# Altium schematic sheet TUDSSL_condenar__Hardware_PCBs_PowerModules_CrankModuleSMARTEST_TUD-EHC-CrankModule_SMARTEST__2_MCU.schdoc
size 309 x 223 mm; Symbol: Sheet-Symbol_A4; Device: Sheet-Symbol_A4; Company: EasyEDA.com; Drawed: EasyEDA Pro; Reviewed: EasyEDA Pro; Version: V0.1; Page Size: A4; @Project Name: TUD-EnergyHarvestingConsole_2022-08-29_17-01-09; @Page Count: 2; @Update Date: 2023-04-17; @Create Date: 2023-01-30; @Schematic Name: TUD-EHC-CrankModule_SMARTEST; Part Number: JLCPCB-002; @Page No: 2; @Page Name: MCU
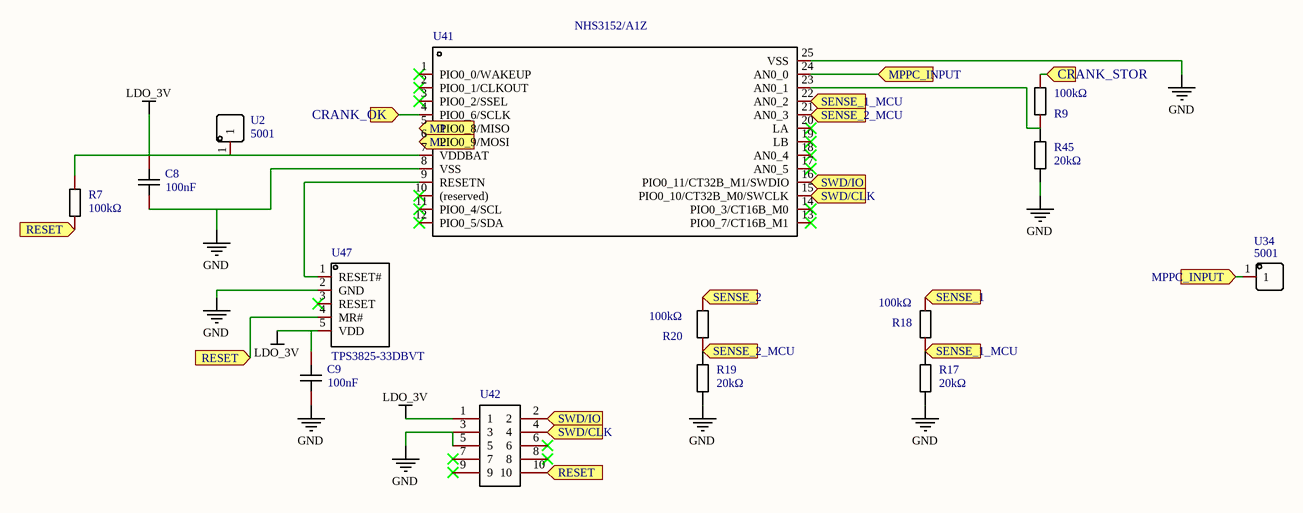
[diagram p0: TUDSSL_condenar__Hardware_PCBs_PowerModules_CrankModuleSMARTEST_TUD-EHC-CrankModule_SMARTEST__2_MCU.schdoc]

## Parts
C8  100nF  [C0603]
C9  100nF  [C0603]
R7  100kΩ  [R0603]
R9  100kΩ  [R0603]
R17  20kΩ  [R0603]
R18  100kΩ  [R0603]
R19  20kΩ  [R0603]
R20  100kΩ  [R0603]
R45  20kΩ  [R0603]
U2  5001  [TEST-TH_BD2.54-P1.39]
U34  5001  [TEST-TH_BD2.54-P1.39]
U41  NHS3152/A1Z  [QFN-24_L4.0-W4.0-P0.50-BL-EP2.6]
U42  20021121-00010T4LF  [HDR-SMD_10P-P1.27-V-M-R2-C5-S1.27-LS5.5]  (value not drawn)
U47  TPS3825-33DBVT  [SOT-23-5_L3.0-W1.7-P0.95-LS2.8-BL]

## Ports
CRANK_OK (in), CRANK_STOR (in), M1 (in), M2 (in), MPPC_INPUT (in), RESET (in), SENSE_1 (in), SENSE_1_MCU (in), SENSE_2 (in), SENSE_2_MCU (in), SWD/CLK (in), SWD/IO (in)

## Nets
GND: C8.2 C9.2 R17.2 R19.2 R45.2 U41.8(VSS) U41.25(VSS) U42.3 U42.5 U47.2(GND)
LDO_3V: C8.1 C9.1 R7.1 U2.1 U41.7(VDDBAT) U42.1 U47.5(VDD)
CRANK_OK: U41.4(PIO0_6/SCLK) ; port CRANK_OK
CRANK_STOR: R9.2 ; port CRANK_STOR
M1: U41.5(PIO0_8/MISO) ; port M1
M2: U41.6(PIO0_9/MOSI) ; port M2
MPPC_INPUT: U34.1 U41.24(AN0_0) ; port MPPC_INPUT
RESET: R7.2 U42.10 U47.4(MR#) ; port RESET
SENSE_1: R18.2 ; port SENSE_1
SENSE_1_MCU: R17.1 R18.1 U41.22(AN0_2) ; port SENSE_1_MCU
SENSE_2: R20.2 ; port SENSE_2
SENSE_2_MCU: R19.1 R20.1 U41.21(AN0_3) ; port SENSE_2_MCU
SWD/CLK: U41.15(PIO0_10/CT32B_M0/SWCLK) U42.4 ; port SWD/CLK
SWD/IO: U41.16(PIO0_11/CT32B_M1/SWDIO) U42.2 ; port SWD/IO
NetR9_1: R9.1 R45.1 U41.23(AN0_1)
NetU41_9: U41.9(RESETN) U47.1(RESET#)

Not connected (* = marked no-connect by the designer): U41 1(PIO0_0/WAKEUP)* 2(PIO0_1/CLKOUT)* 3(PIO0_2/SSEL)* 10((reserved))* 11(PIO0_4/SCL)* 12(PIO0_5/SDA)* 13(PIO0_7/CT16B_M1)* 14(PIO0_3/CT16B_M0)* 17(AN0_5)* 18(AN0_4)* 19(LB)* 20(LA)*; U42 6* 7* 8* 9*; U47 3(RESET)*

## Notes on the sheet
- 1
- 2
- 3
- 4
- 5
- 6
- A
- B
- C
- Schematic
- TUD-EHC-CrankModule_SMARTEST
- Create Date
- Update Date
- 2023-04-17
- 2023-01-30
- Reviewed
- Drawed
- Page
- EasyEDA Pro
- MCU
- Part Number
- TUD-EnergyHarvestingConsole_2022-08-29_17-01-09
- JLCPCB-002
- D
- VER
- SIZE
- PAGE
- OF
- V0.1
- A4
- EasyEDA.com

## Library data of the parts
C8 C9 = CC0603KRX7R9BB104: Manufacturer: YAGEO; Convert to PCB: yes; Name: 100nF; Symbol: 100nF; Device: CC0603KRX7R9BB104; Supplier: LCSC; Manufacturer Part: CC0603KRX7R9BB104; Supplier Part: C14663; JLCPCB Part Class: Basic; Add into BOM: yes; Origin Footprint: C0603
R7 R9 R18 R20 = 0603WAF1003T5E: Type:Thick Film Resistors Resistance: Tolerance:±1% Tolerance:±1% Power(Watts): Temperature Coefficient:±100ppm/℃ Temperature Coefficient:±100ppm/℃ Overload Voltage (Max): Operating Temperature Range:-55℃~+155℃ Operating Temperature Range:-55℃~+155℃; Manufacturer: UNI-ROYAL(厚声); Add into BOM: yes; Tolerance: ±1%; Name: 100kΩ; Symbol: 0603WAF1003T5E; Device: 0603WAF1003T5E; LCSC Part Name: 100kΩ ±1% 100mW; Supplier Part: C25803; Manufacturer Part: 0603WAF1003T5E; Supplier Footprint: 0603; JLCPCB Part Class: Basic Part; Datasheet: https://atta.szlcsc.com/upload/public/pdf/source/20200306/C422600_1E6D84923E4A46A82E41ADD87F860B5C.pdf; Supplier: LCSC; Convert to PCB: yes; Type: Thick Film Resistors; Value: 100kΩ; Temperature Coefficient: ±100ppm/℃; Operating Temperature Range: -55℃~+155℃
R17 R19 R45 = 0603WAF2002T5E: Manufacturer: UniOhm; Resistance: 20K; Convert to PCB: yes; Name: 20kΩ; Symbol: 20kΩ; Device: 0603WAF2002T5E; Supplier: LCSC; Manufacturer Part: 0603WAF2002T5E; Supplier Part: C4184; JLCPCB Part Class: Basic Part; Add into BOM: yes; Origin Footprint: R0603
U2 U34 = 5001: Manufacturer: Keystone; Convert to PCB: yes; Name: 5001; Symbol: 5001; Device: 5001; Supplier: LCSC; Supplier Part: C238122; Manufacturer Part: 5001; JLCPCB Part Class: Extended Part; Add into BOM: yes; Origin Footprint: TEST-TH_BD2.54-P1.39
U41 = NHS3152/A1Z: Manufacturer: NXP(恩智浦); Add into BOM: yes; Name: NHS3152/A1Z; Symbol: NHS3152/A1Z; Device: NHS3152/A1Z; LCSC Part Name: NHS3152/A1Z; Supplier Part: C2654832; Manufacturer Part: NHS3152/A1Z; Supplier Footprint: HVQFN-24(4x4); JLCPCB Part Class: Extended Part; Datasheet: https://atta.szlcsc.com/upload/public/pdf/source/20210612/5160445B57F69F44302DE5787B3ADA6D.pdf; Supplier: LCSC; Convert to PCB: yes
U42 = 20021121-00010T4LF: Manufacturer: Amphenol; Add into BOM: yes; Name: 20021121-00010T4LF; Symbol: 20021121-00010T4LF; Device: 20021121-00010T4LF; LCSC Part Name: 2x5P P=1.27mm; Supplier Part: C598540; Manufacturer Part: 20021121-00010T4LF; Supplier Footprint: SMD,P=1.27mm; JLCPCB Part Class: Extended Part; Datasheet: https://atta.szlcsc.com/upload/public/pdf/source/20210513/C598542_FDB1876580D2C5E95E826F89938B3DC0.pdf; Supplier: LCSC; Convert to PCB: yes
U47 = TPS3825-33DBVT: Type: Voltage - Threshold: Number of Voltages Monitored: Output: Reset:; Manufacturer: TI(德州仪器); Add into BOM: yes; Name: TPS3825-33DBVT; Symbol: TPS3825-33DBVT; Device: TPS3825-33DBVT; LCSC Part Name: TPS3825-33DBVT; Supplier Part: C131921; Manufacturer Part: TPS3825-33DBVT; Supplier Footprint: SOT-23-5; JLCPCB Part Class: Extended Part; Datasheet: https://atta.szlcsc.com/upload/public/pdf/source/20170925/C131921_1506321498976990285.pdf; Supplier: LCSC; Convert to PCB: yes